# EAGLE design usb2rs232_v2.3 (EAGLE 6.5.0)
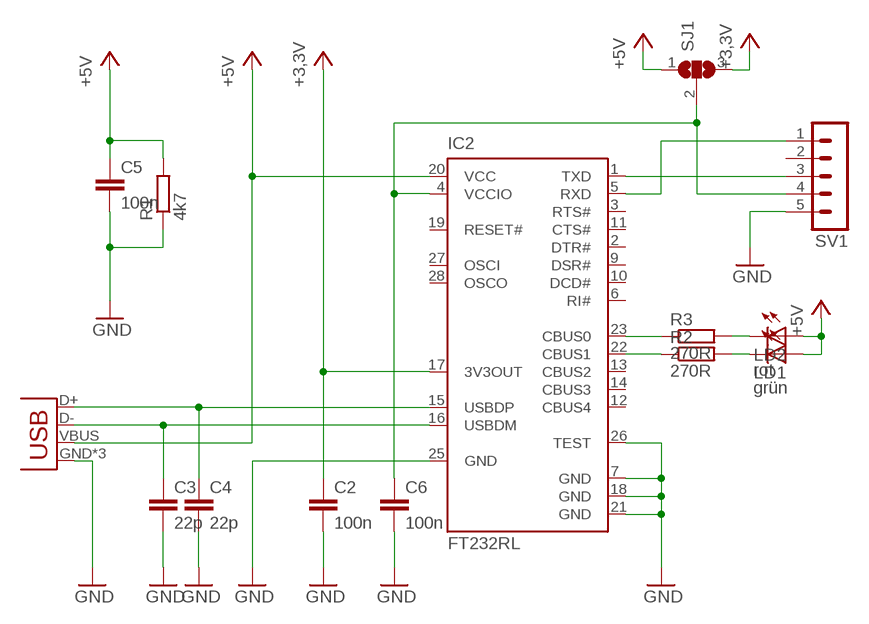
[diagram p0: schematic, sheet 1]

## Parts
C2  100n  C-EUC0603  [C0603]
C3  22p  C-EUC0603  [C0603]
C4  22p  C-EUC0603  [C0603]
C5  100n  C-EUC0603  [C0603]
C6  100n  C-EUC0603  [C0603]
IC2  FT232RL  [SSOP28]
JP2  USB-MICROB  [USB-MICROB]
LD1  grün  LEDCHIP-LED0603  [CHIP-LED0603]
LD2  rot  LEDCHIP-LED0603  [CHIP-LED0603]
R1  4k7  R-EU_R0603  [R0603]
R2  270R  R-EU_R0603  [R0603]
R3  270R  R-EU_R0603  [R0603]
SJ1  SJ2W  [SJ_2]
SV1  MA05-1  [MA05-1]

## Nets
+3,3V: C2.1 IC2.17(3V3OUT) SJ1.3
+5V [pwr]: C5.1 IC2.20(VCC) JP2.VBUS LD1.A LD2.A R1.2 SJ1.1
GND [pwr]: C2.2 C3.2 C4.2 C5.2 C6.2 IC2.7(GND) IC2.18(GND) IC2.21(GND) IC2.25(GND) IC2.26(TEST) JP2.GND JP2.MT1(GND) JP2.MT2(GND) R1.1 SV1.5
N$1: IC2.23(CBUS0) R3.1
N$2: IC2.22(CBUS1) R2.1
N$3: C4.1 IC2.15(USBDP) JP2.D+
N$4: C3.1 IC2.16(USBDM) JP2.D-
N$5: C6.1 IC2.4(VCCIO) SJ1.2 SV1.4
N$6: LD1.C R2.2
N$7: LD2.C R3.2
N$8: IC2.5(RXD) SV1.1
N$9: IC2.1(TXD) SV1.3
Unconnected: IC2.2(DTR#) IC2.3(RTS#) IC2.6(RI#) IC2.9(DSR#) IC2.10(DCD#) IC2.11(CTS#) IC2.12(CBUS4) IC2.13(CBUS2) IC2.14(CBUS3) IC2.19(RESET#) IC2.27(OSCI) IC2.28(OSCO) SV1.2

## Library data of the parts
C2-C6 = rcl:C-EU: CAPACITOR, European symbol
IC2 = ftdichip:FT232R: Source: http://www.ftdichip.com/Documents/DataSheets/DS_FT232R_v104.pdf
JP2 = SparkFun-Connectors:USB: USB Connectors USB-B-PTH is fully proven SKU : PRT-00139/CONN-08278 USB-miniB is fully proven SKU : PRT-00587 USB-A-PCB is untested. USB-A-H is throughly reviewed, but untested. Spark Fun Electronics SKU : PRT-00437 USB-B-SMT is throughly reviewed, but untested. Needs silkscreen touching up. USB-A-S has not been used/tested USB-MB-H has not been used/tested USB-MICROB has been used. CONN-09505; PROD_ID: CONN-09505
LD1 LD2 = led:LED: LED OSRAM: - CHIPLED LG R971, LG N971, LY N971, LG Q971, LY Q971, LO R971, LY R971 LH N974, LH R974 LS Q976, LO Q976, LY Q976 LO Q996 - Hyper CHIPLED LW Q18S LB Q993, LB Q99A, LB R99A - SideLED LS A670, LO A670, LY A670, LG A670, LP A670 LB A673, LV A673, LT A673, LW A673 LH A674 LY A675 LS A676, LA A676, LO A676, LY A676, LW A676 LS A679, LY A679, LG A679 - Hyper Micro SIDELED® LS Y876, LA Y876, LO Y876, LY Y876 LT Y87S - SmartLED LW L88C, LW L88S LB L89C, LB L89S, LG L890 LS L89K, LO L89K, LY L89K LS L896, LA L896, LO L896, LY L896 - TOPLED LS T670, LO T670, LY T670, LG T670, LP T670 LSG T670, LSP T670, LSY T670, LOP T670, LYG T670 LG T671, LOG T671, LSG T671 LB T673, LV T673, LT T673, LW T673 LH T674 LS T676, LA T676, LO T676, LY T676, LB T676, LH T676, LSB T676, LW T676 LB T67C, LV T67C, LT T67C, LS T67K, LO T67K, LY T67K, LW E67C LS E67B, LA E67B, LO E67B, LY E67B, LB E67C, LV E67C, LT E67C LW T67C LS T679, LY T679, LG T679 LS T770, LO T770, LY T770, LG T770, LP T770 LB T773, LV T773, LT T773, LW T773 LH T774 LS E675, LA E675, LY E675, LS T675 LS T776, LA T776, LO T776, LY T776, LB T776 LHGB T686 LT T68C, LB T68C - Hyper Mini TOPLED® LB M676 - Mini TOPLED Santana® LG M470 LS M47K, LO M47K, LY M47K Source: http://www.osram.convergy.de/
R1-R3 = rcl:R-EU_: RESISTOR, European symbol
SJ1 = jumper:SJ2W: SMD solder JUMPER
SV1 = con-lstb:MA05-1: PIN HEADER

## Net classes
1 pwr: width 0.152 mm, drill 0.305 mm, clearance 0.152 mm

## Board
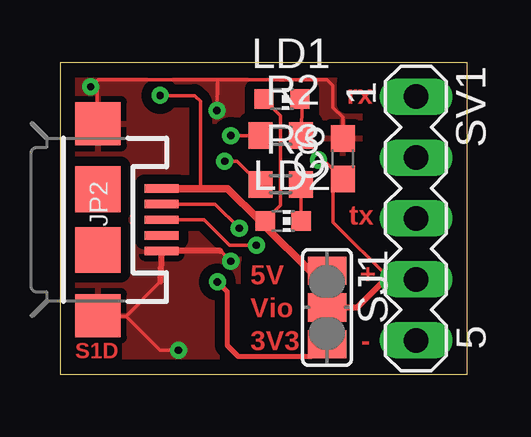
[diagram p1: board, top side]
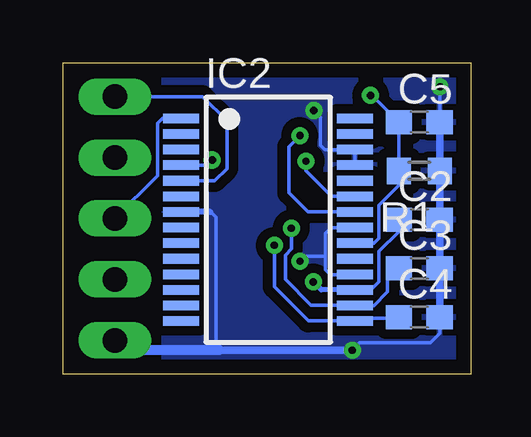
[diagram p2: board, bottom side, seen from below]

Size 16.99 x 12.99 mm. Coordinates in mm from the lower left corner, seen from the top.
Outline: 0,0 16.99,0 16.99,12.99 0,12.99 0,0
Copper layers (1*16): Top 0.035mm / dielectric 1.5mm / Bottom 0.035mm
Design rules "default": minimum track width 6mil, minimum drill 12mil, track to track 6mil, track to pad 6mil, pad to pad 6mil, via to via 6mil, smd to smd 6mil, copper to edge 24mil, drill to drill 8mil, minimum pad ring 10mil, minimum via ring 8mil, stop-mask expansion 4mil, vias tented up to drill 12mil, thermal gap 10mil

### Footprints (pad centres in the part's own frame; a part is rotated, then mirrored left to right if it is on the bottom)
C0603 = smd 1.1 x 1: 1 -0.85,0; 2 0.85,0
SSOP28 = smd 0.4 x 1.5: 1 -4.225,-3.625; 2 -3.575,-3.625; 3 -2.925,-3.625; 4 -2.275,-3.625; 5 -1.625,-3.625; 6 -0.975,-3.625; 7 -0.325,-3.625; 8 0.325,-3.625; 9 0.975,-3.625; 10 1.625,-3.625; 11 2.275,-3.625; 12 2.925,-3.625; 13 3.575,-3.625; 14 4.225,-3.625; 15 4.225,3.625; 16 3.575,3.625; 17 2.925,3.625; 18 2.275,3.625; 19 1.625,3.625; 20 0.975,3.625; 21 0.325,3.625; 22 -0.325,3.625; 23 -0.975,3.625; 24 -1.625,3.625; 25 -2.275,3.625; 26 -2.925,3.625; 27 -3.575,3.625; 28 -4.225,3.625
USB-MICROB = smd 0.35 x 1.4: D+ 0,2.65; D- -0.65,2.65; GND 1.3,2.65; ID 0.65,2.65; VBUS -1.3,2.65 | smd 1.8 x 1.9: MT1 -4,0; MT2 4,0 | smd 1.9 x 1.9: P$1 -1.27,0; P$2 1.27,0
CHIP-LED0603 = smd 0.8 x 0.8: A 0,-0.75; C 0,0.75
R0603 = smd 1 x 1.1: 1 -0.85,0; 2 0.85,0
SJ_2 = smd 1.168 x 1.6: 1 -1.524,0; 2 0,0; 3 1.524,0
MA05-1 = drill 1.016 long: 1 -5.08,0; 2 -2.54,0; 3 0,0; 4 2.54,0; 5 5.08,0

### Placement (x,y rotation side)
C2  2.15,6.45 0 bottom
C3  2.15,4.41 0 bottom
C4  2.15,2.38 0 bottom
C5  2.15,10.51 0 bottom
C6  11.8,8.99 90 top
IC2  8.45,6.45 270 bottom
JP2  1.59,6.45 270 top
LD1  9.26,11.48 270 top
LD2  9.31,6.4 270 top
R1  2.15,8.48 180 bottom
R2  9.21,9.95 0 top
R3  9.21,7.92 0 top
SJ1  11.14,2.79 270 top
SV1  14.85,6.5 270 top

### Tracks (layer width: path | path; a pad name or v marks a point on that pad's centre or on a via)
+3,3V  (via drill 0.3)
  Top 0.152: 10.99,1.27 SJ1.3
  Top 0.203: v6.57,3.86 6.97,3.45 6.97,1.21 7.43,0.76 10.48,0.76 10.99,1.27
  Bottom 0.152: IC2.17 4.16,3.52 3.82,3.86 3.82,5.13 3,5.95 C2.1
  Bottom 0.203: IC2.17 6.23,3.52 v6.57,3.86
+5V  (via drill 0.3)
  Top 0.152: 8.39,6.4 LD2.A | LD2.A 8.56,6.18 | LD1.A 9.21,10.78 9.21,7.04 LD2.A | v4.18,11.63 4.19,11.62 5.61,11.62 5.85,11.37 5.85,7.85 5.96,7.75
  Top 0.305: 8.56,6.18 10.43,4.31 SJ1.1 | 8.39,6.4 8.34,6.45 8.29,6.45 6.99,7.75 5.96,7.75 JP2.VBUS
  Bottom 0.152: IC2.20 4.04,5.47 3.82,5.68 3.82,7.06 3,7.88 R1.2 C5.1 4.11,11.63 v4.18,11.63
GND  (via drill 0.3)
  Top 0.152: C6.2 11.8,10.71 11.39,11.12 11.39,12.03 11.14,12.29 6.57,12.29 | v6.54,11 6.57,12.29 | JP2.MT1 1.54,12.24 | 6.57,12.29 1.59,12.29 1.54,12.24 | 4.19,3.86 2.76,2.43 | 2.76,2.43 1.55,2.43 JP2.MT2 | v4.94,1.01 4.18,1.01 2.76,2.43 | v1.28,11.98 1.54,12.24 | v7.12,4.72 6.7,5.15
  Top 0.254: 4.19,3.86 JP2.GND 6.7,5.15
  Bottom 0.152: 6.06,4.92 6.06,4.36 5.85,4.16 4.83,4.16 IC2.18 | 6.06,4.92 6.06,5.89 5.82,6.12 IC2.21 4.8,6.14 | 4.81,8.73 IC2.25 IC2.26 6.09,9.37 6.26,9.55 6.26,10.71 v6.54,11 | v7.12,4.72 6.92,4.92 6.06,4.92 | IC2.7 12.09,6.75 | 10.85,6.77 10.63,6.55 10.63,1.16 10.48,1.01 | C4.2 1.3,1.71 1.69,1.32 4.64,1.32 v4.94,1.01 | C5.2 1.3,12.22 v1.28,11.98
  Bottom 0.254: 10.85,6.77 IC2.7
  Bottom 0.305: C5.2 R1.1 C2.2 C3.2 C4.2 | v4.94,1.01 10.48,1.01
  Bottom 0.406: SV1.5 14.24,1.01 10.48,1.01
  pour Top (isolate 0.406): 0.22,12.85 0.22,0.15 12.51,0.15 12.51,12.85
  pour Bottom (isolate 0.406): 0.22,12.85 0.22,0.15 12.76,0.15 12.76,12.85
N$1  (via drill 0.3)
  Top 0.152: v6.87,8.89 7.39,8.89 R3.1
  Bottom 0.152: IC2.23 5.81,7.42 6.87,8.48 v6.87,8.89
N$2  (via drill 0.3)
  Top 0.152: v7.12,9.95 R2.1
  Bottom 0.152: IC2.22 6.79,6.77 7.58,7.56 7.58,9.49 v7.12,9.95
N$3  (via drill 0.3)
  Top 0.152: v8.19,5.38 7.07,5.38 6.01,6.45 JP2.D+
  Bottom 0.152: C4.1 3.05,2.33 4.71,2.33 IC2.15 6.77,2.23 8.19,3.65 v8.19,5.38
N$4  (via drill 0.3)
  Top 0.152: JP2.D- 6.47,7.1 v7.48,6.09
  Bottom 0.152: v7.48,6.09 7.48,5.23 7.73,4.97 7.73,3.96 6.67,2.89 4.84,2.89 IC2.16 4.04,2.87 3.47,3.45 3.47,3.94 C3.1
N$5  (via drill 0.3)
  Top 0.152: 13.63,3.96 SV1.4 13.78,3.96 11.39,6.35 11.39,7.73 C6.1 11,8.94 v10.78,8.94
  Top 0.254: SV1.4 13.58,3.96 12.41,2.79 SJ1.2
  Bottom 0.152: IC2.4 11,8.72 v10.78,8.94
N$6
  Top 0.152: R2.2 10.11,11.38 LD1.C
N$7
  Top 0.152: R3.2 10.06,7.87 LD2.C
N$8
  Bottom 0.152: SV1.1 11.19,11.58 10.17,10.56 10.17,8.58 10.68,8.07 IC2.5
N$9
  Bottom 0.152: IC2.1 12.86,10.67 13.07,10.46 13.07,8.28 SV1.3

### Text on the board
Top: rx | tx | 5V | + | Vio | S1D | 3V3 | -